# EAGLE design Oddjobv3 (EAGLE 6.4)
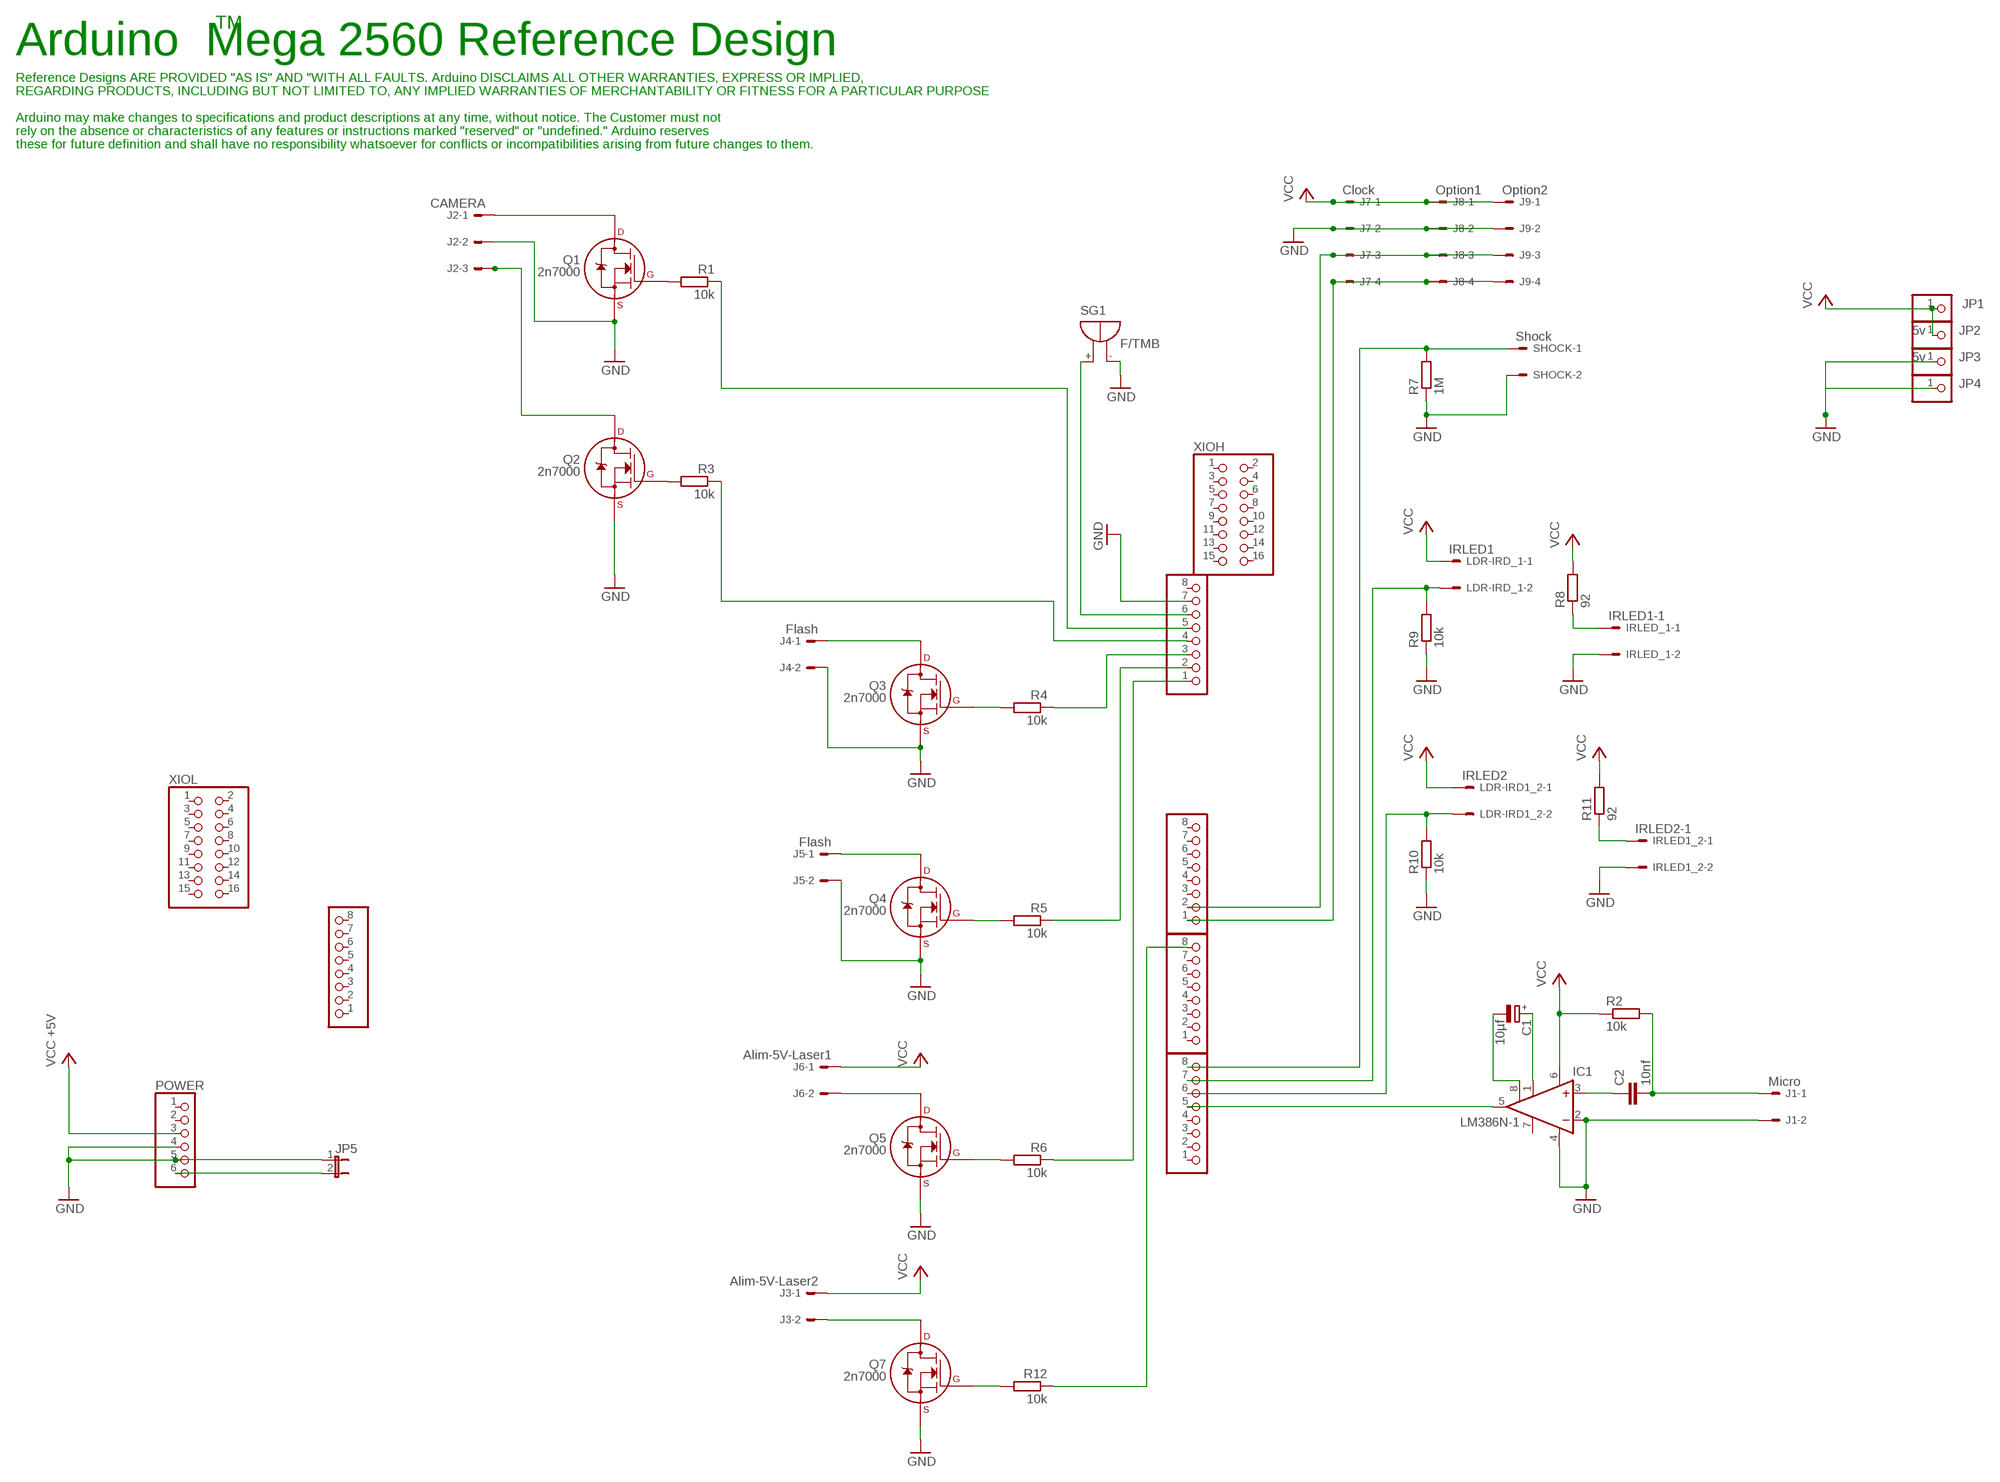
[diagram p0: schematic, sheet 1]

## Parts
ADCH  PINHD-1X8  [1X08]
ADCL  PINHD-1X8  [1X08]
C1  10µf  CPOL-EUE2.5-6  [E2,5-6]
C2  10nf  C-EU050-025X075  [C050-025X075]
COMMUNICATION  PINHD-1X8  [1X08]
IC1  LM386N-1  [DIL08]
IRLED1_2  IRLED2-1  22-27-2021-02  [6410-02]
IRLED_1  IRLED1-1  22-27-2021-02  [6410-02]
J1  Micro  22-27-2021-02  [6410-02]
J2  CAMERA  22-27-2031-03  [6410-03]
J3  Alim-5V-Laser2  22-27-2021-02  [6410-02]
J4  Flash  22-27-2021-02  [6410-02]
J5  Flash  22-27-2021-02  [6410-02]
J6  Alim-5V-Laser1  22-27-2021-02  [6410-02]
J7  Clock  22-27-2041-04  [6410-04]
J8  Option1  22-27-2041-04  [6410-04]
J9  Option2  22-27-2041-04  [6410-04]
JP1  5v  PINHD-1X1  [1X01]
JP2  5v  PINHD-1X1  [1X01]
JP3  PINHD-1X1  [1X01]
JP4  PINHD-1X1  [1X01]
JP5  JP1E  [JP1]
LDR-IRD1_2  IRLED2  22-27-2021-02  [6410-02]
LDR-IRD_1  IRLED1  22-27-2021-02  [6410-02]
POWER  PINHD-1X6  [1X06]
PWMH-NUMERIC  PINHD-1X8  [1X08]
PWML  PINHD-1X8  [1X08]
Q1  2n7000  2N7000_TO92  [TO-92]
Q2  2n7000  2N7000_TO92  [TO-92]
Q3  2n7000  2N7000_TO92  [TO-92]
Q4  2n7000  2N7000_TO92  [TO-92]
Q5  2n7000  2N7000_TO92  [TO-92]
Q7  2n7000  2N7000_TO92  [TO-92]
R1  10k  R-EU_0207/7  [0207/7]
R2  10k  R-EU_0207/7  [0207/7]
R3  10k  R-EU_0207/7  [0207/7]
R4  10k  R-EU_0207/7  [0207/7]
R5  10k  R-EU_0207/7  [0207/7]
R6  10k  R-EU_0207/7  [0207/7]
R7  1M  R-EU_0207/7  [0207/7]
R8  92  R-EU_0207/7  [0207/7]
R9  10k  R-EU_0207/7  [0207/7]
R10  10k  R-EU_0207/7  [0207/7]
R11  92  R-EU_0207/7  [0207/7]
R12  10k  R-EU_0207/7  [0207/7]
SG1  F/TMB  [F/TMB]
SHOCK  Shock  22-27-2021-02  [6410-02]
XIOH  PINHD-2X8  [2X08]
XIOL  PINHD-2X8  [2X08]

## Nets
GND: IC1.2(-IN) IC1.4(GND) IRLED1_2.2 IRLED_1.2 J1.2 J2.2 J4.2 J5.2 J7.2 J8.2 J9.2 JP3.1 JP4.1 JP5.1 POWER.4 POWER.5 PWMH-NUMERIC.7 Q1.1(S) Q2.1(S) Q3.1(S) Q4.1(S) Q5.1(S) Q7.1(S) R7.1 R9.1 R10.1 SG1.- SHOCK.2
N$1: Q1.2(G) R1.2
N$2: J2.1 Q1.3(D)
N$3: C1.+ IC1.1(GAIN)
N$4: C1.- IC1.8(GAIN)
N$5: C2.1 IC1.3(+IN)
N$6: C2.2 J1.1 R2.2
N$7: Q2.2(G) R3.2
N$8: J2.3 Q2.3(D)
N$9: PWMH-NUMERIC.6 SG1.+
N$10: Q3.2(G) R4.2
N$11: J4.1 Q3.3(D)
N$12: J6.2 Q5.3(D)
N$13: Q4.2(G) R5.2
N$14: J5.1 Q4.3(D)
N$15: Q5.2(G) R6.2
N$16: IRLED_1.1 R8.1
N$17: ADCL.7 LDR-IRD_1.2 R9.2
N$18: ADCL.6 LDR-IRD1_2.2 R10.2
N$19: IRLED1_2.1 R11.1
N$20: PWMH-NUMERIC.1 R6.1
N$21: PWMH-NUMERIC.5 R1.1
N$22: PWMH-NUMERIC.2 R5.1
N$23: PWMH-NUMERIC.4 R3.1
N$24: PWMH-NUMERIC.3 R4.1
N$25: ADCL.5 IC1.5(OUT)
N$26: Q7.2(G) R12.2
N$27: J3.2 Q7.3(D)
N$28: ADCL.8 R7.2 SHOCK.1
N$29: COMMUNICATION.1 J7.4 J8.4 J9.4
N$30: PWML.8 R12.1
N$31: COMMUNICATION.2 J7.3 J8.3 J9.3
N$32: JP5.2 POWER.6
VCC: IC1.6(VS) J3.1 J6.1 J7.1 J8.1 J9.1 JP1.1 JP2.1 LDR-IRD1_2.1 LDR-IRD_1.1 POWER.3 R2.1 R8.2 R11.2 ; supply symbol labelled VCC +5V
Unconnected: ADCH.1 ADCH.2 ADCH.3 ADCH.4 ADCH.5 ADCH.6 ADCH.7 ADCH.8 ADCL.1 ADCL.2 ADCL.3 ADCL.4 COMMUNICATION.3 COMMUNICATION.4 COMMUNICATION.5 COMMUNICATION.6 COMMUNICATION.7 COMMUNICATION.8 IC1.7(BYPASS) POWER.1 POWER.2 PWMH-NUMERIC.8 PWML.1 PWML.2 PWML.3 PWML.4 PWML.5 PWML.6 PWML.7 XIOH.1 XIOH.2 XIOH.3 XIOH.4 XIOH.5 XIOH.6 XIOH.7 XIOH.8 XIOH.9 XIOH.10 XIOH.11 XIOH.12 XIOH.13 XIOH.14 XIOH.15 XIOH.16 XIOL.1 XIOL.2 XIOL.3 XIOL.4 XIOL.5 XIOL.6 XIOL.7 XIOL.8 XIOL.9 XIOL.10 XIOL.11 XIOL.12 XIOL.13 XIOL.14 XIOL.15 XIOL.16

## Notes on the sheet
- TM
- Arduino  Mega 2560 Reference Design
- Reference Designs ARE PROVIDED "AS IS" AND "WITH ALL FAULTS. Arduino DISCLAIMS ALL OTHER WARRANTIES, EXPRESS OR IMPLIED,
- REGARDING PRODUCTS, INCLUDING BUT NOT LIMITED TO, ANY IMPLIED WARRANTIES OF MERCHANTABILITY OR FITNESS FOR A PARTICULAR PURPOSE
- Arduino may make changes to specifications and product descriptions at any time, without notice. The Customer must not
- rely on the absence or characteristics of any features or instructions marked "reserved" or "undefined." Arduino reserves
- these for future definition and shall have no responsibility whatsoever for conflicts or incompatibilities arising from future changes to them.

## Library data of the parts
ADCH ADCL COMMUNICATION PWMH-NUMERIC PWML = pinhead:PINHD-1X8: PIN HEADER
C1 = resistor:CPOL-EU: POLARIZED CAPACITOR, European symbol
C2 = resistor:C-EU: CAPACITOR, European symbol
IC1 = linear:LM386?-*: Low Voltage Audio Power Amplifier Source: http://cache.national.com/ds/LM/LM386.pdf
IRLED1_2 IRLED_1 J1 J3-J6 LDR-IRD1_2 LDR-IRD_1 SHOCK = con-molex:22-?-02: CONNECTOR wire to board 2.54 mm (.1 inch) pitch header; OC_FARNELL: unknown; OC_NEWARK: unknown
J2 = con-molex:22-?-03: CONNECTOR wire to board 2.54 mm (.1 inch) pitch header; OC_FARNELL: unknown; OC_NEWARK: unknown
J7-J9 = con-molex:22-?-04: CONNECTOR wire to board 2.54 mm (.1 inch) pitch header; OC_FARNELL: unknown; OC_NEWARK: unknown
JP1-JP4 = pinhead:PINHD-1X1: PIN HEADER
JP5 = jumper:JP1E: JUMPER
POWER = pinhead:PINHD-1X6: PIN HEADER
Q1-Q5 Q7 = transistors:2N700*: 2N7000, 2N7002, NDS7002A N-channel enhancement mode MOSFET
R1-R12 = resistor:R-EU_: RESISTOR, European symbol
SG1 = buzzer:F/TMB: BUZZER Source: Buerklin; OC_FARNELL: unknown; OC_NEWARK: unknown
XIOH XIOL = pinhead:PINHD-2X8: PIN HEADER

## Net classes
0 default: width 0.152 mm, drill 0.305 mm, clearance 0.152 mm

## Board
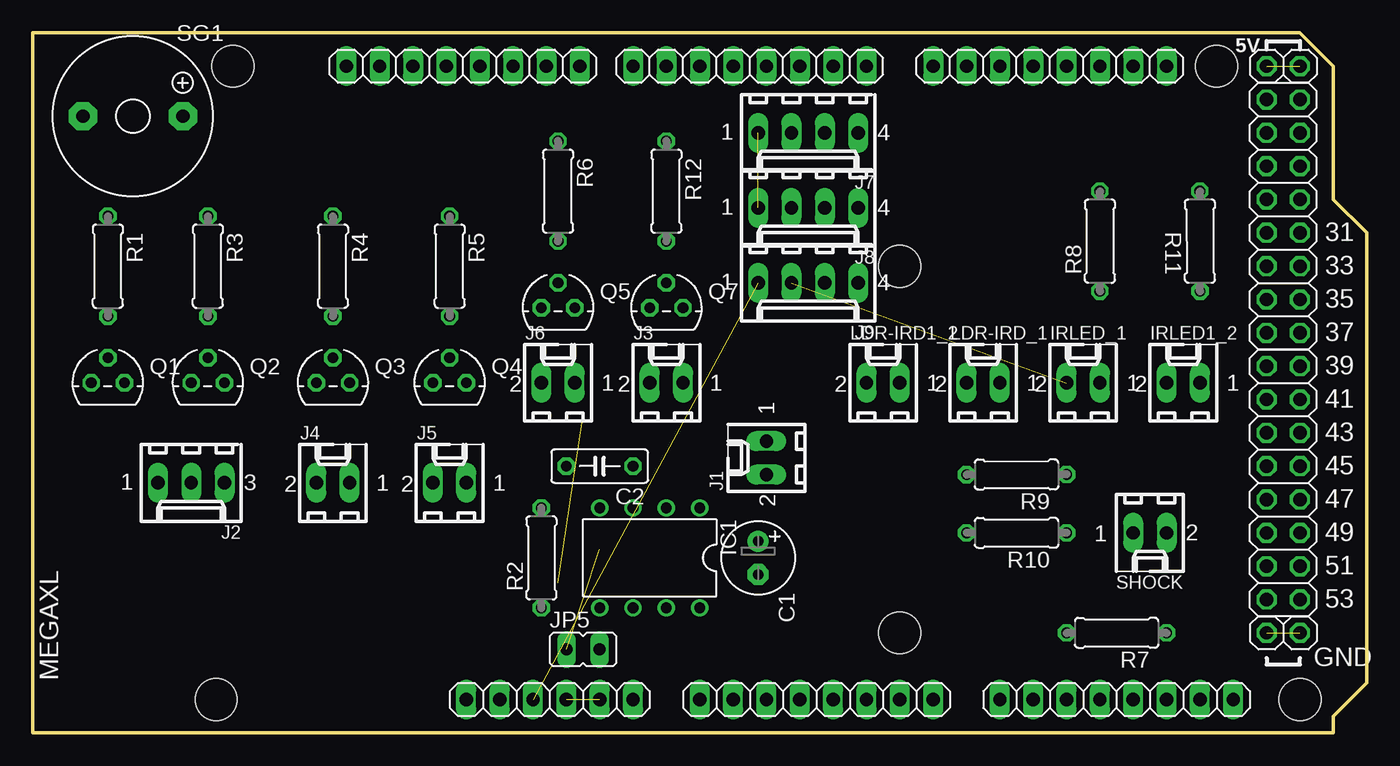
[diagram p1: board, top side]
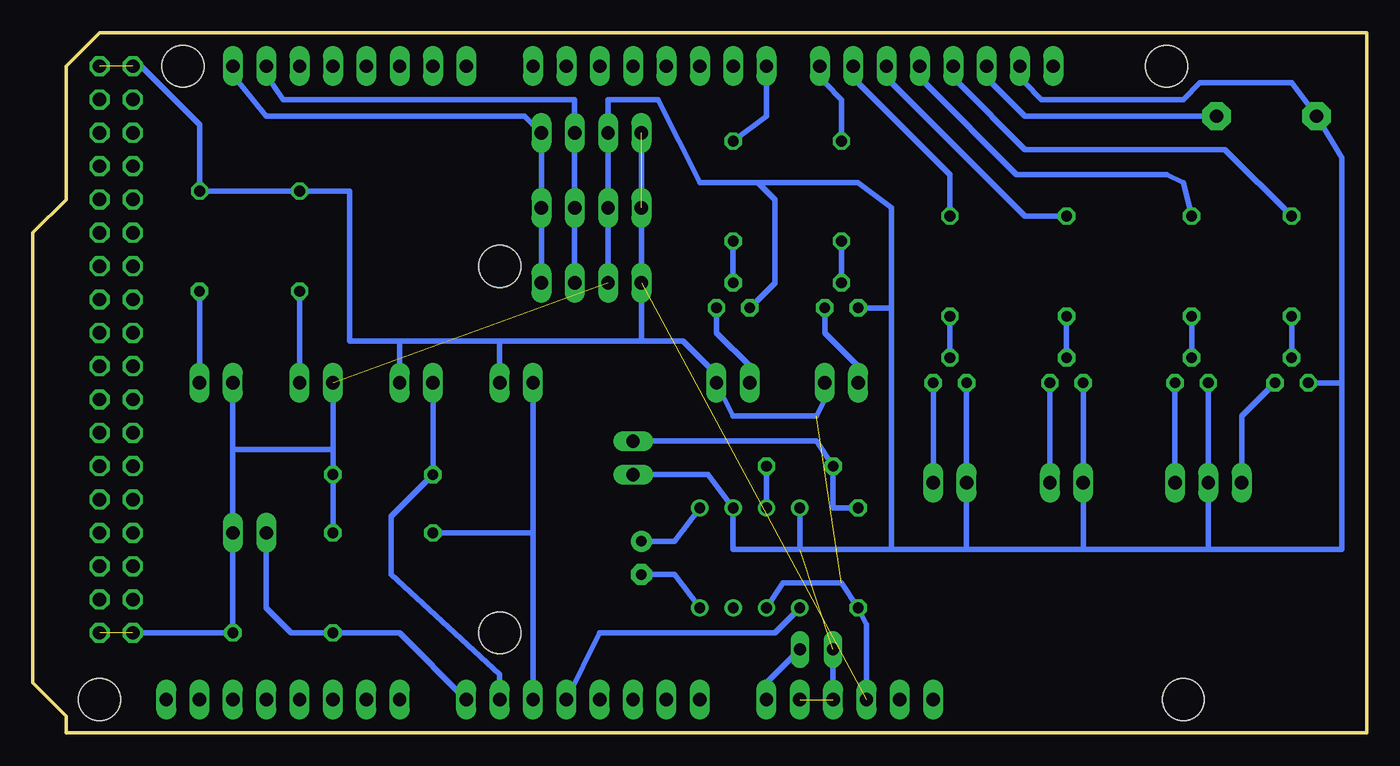
[diagram p2: board, bottom side, seen from below]

Size 101.6 x 53.34 mm. Coordinates in mm from the lower left corner, seen from the top.
Outline: 0,53.34 96.52,53.34 99.06,50.8 99.06,40.64 101.6,38.1 101.6,3.81 99.06,1.27 99.06,0 0,0 0,53.34
Copper layers 1: Top 0.035mm
Design rules "default": minimum track width 6mil, minimum drill 12mil, track to track 6mil, track to pad 6mil, pad to pad 6mil, via to via 6mil, smd to smd 6mil, copper to edge 40mil, drill to drill 12mil, minimum pad ring 10mil, minimum via ring 10mil, stop-mask expansion 2mil, vias tented up to drill 1mil, thermal gap 10mil
Holes 3.2 mm at 96.52,2.54 15.24,50.8 90.17,50.8 13.97,2.54 66.04,35.56 66.04,7.62

### Footprints (pad centres in the part's own frame; a part is rotated, then mirrored left to right if it is on the bottom)
1X08 = drill 1.016 long: 1 -8.89,0; 2 -6.35,0; 3 -3.81,0; 4 -1.27,0; 5 1.27,0; 6 3.81,0; 7 6.35,0; 8 8.89,0
E2,5-6 = drill 0.813 pad 1.6: + -1.27,0 | drill 0.813 pad 1.6 octagon: - 1.27,0
C050-025X075 = drill 0.813 octagon: 1 -2.54,0; 2 2.54,0
DIL08 = drill 0.813 pad 1.27: 1 -3.81,-3.81; 2 -1.27,-3.81; 3 1.27,-3.81; 4 3.81,-3.81; 5 3.81,3.81; 6 1.27,3.81; 7 -1.27,3.81; 8 -3.81,3.81
6410-02 = drill 1.016 long: 1 1.27,0; 2 -1.27,0
6410-03 = drill 1.016 long: 1 2.54,0; 2 0,0; 3 -2.54,0
6410-04 = drill 1.016 long: 1 3.81,0; 2 1.27,0; 3 -1.27,0; 4 -3.81,0
1X01 = drill 1.016 octagon: 1 0,0
JP1 = drill 0.914 long: 1 0,-1.27; 2 0,1.27
1X06 = drill 1.016 long: 1 -6.35,0; 2 -3.81,0; 3 -1.27,0; 4 1.27,0; 5 3.81,0; 6 6.35,0
TO-92 = drill 0.813 octagon: 1 -1.27,0; 2 0,1.905; 3 1.27,0
0207/7 = drill 0.813 octagon: 1 -3.81,0; 2 3.81,0
F/TMB = drill 1.016 pad 2.159 octagon: + 3.81,0; - -3.81,0
2X08 = drill 1.016 octagon: 1 -8.89,-1.27; 2 -8.89,1.27; 3 -6.35,-1.27; 4 -6.35,1.27; 5 -3.81,-1.27; 6 -3.81,1.27; 7 -1.27,-1.27; 8 -1.27,1.27; 9 1.27,-1.27; 10 1.27,1.27; 11 3.81,-1.27; 12 3.81,1.27; 13 6.35,-1.27; 14 6.35,1.27; 15 8.89,-1.27; 16 8.89,1.27

### Placement (x,y rotation side)
ADCH  82.55,2.54 0 top
ADCL  59.69,2.54 0 top
C1  55.24,13.34 270 top
C2  43.18,20.32 180 top
COMMUNICATION  77.47,50.8 180 top
IC1  46.99,13.34 180 top
IRLED1_2  87.63,26.67 0 top
IRLED_1  80.01,26.67 0 top
J1  55.88,20.95 90 top
J2  12.06,19.05 180 top
J3  48.26,26.67 0 top
J4  22.86,19.05 0 top
J5  31.75,19.05 0 top
J6  40.01,26.67 0 top
J7  59.05,45.72 180 top
J8  59.05,40.01 180 top
J9  59.05,34.29 180 top
JP1  93.98,50.8 0 top
JP2  96.52,50.8 0 top
JP3  93.98,7.62 0 top
JP4  96.52,7.62 0 top
JP5  41.91,6.35 270 top
LDR-IRD1_2  64.77,26.67 0 top
LDR-IRD_1  72.39,26.67 0 top
POWER  39.37,2.54 0 top
PWMH-NUMERIC  32.77,50.8 180 top
PWML  54.61,50.8 180 top
Q1  5.71,26.67 0 top
Q2  13.34,26.67 0 top
Q3  22.86,26.67 0 top
Q4  31.75,26.67 0 top
Q5  40.01,32.38 0 top
Q7  48.26,32.38 0 top
R1  5.71,35.56 270 top
R2  38.73,13.34 90 top
R3  13.34,35.56 270 top
R4  22.86,35.56 270 top
R5  31.75,35.56 270 top
R6  40.01,41.27 270 top
R7  82.55,7.62 180 top
R8  81.28,37.47 90 top
R9  74.93,19.68 180.1 top
R10  74.93,15.24 180 top
R11  88.9,37.47 90.1 top
R12  48.26,41.27 270 top
SG1  7.62,46.99 0 top
SHOCK  85.09,15.24 180 top
XIOH  95.25,39.37 90 top
XIOL  95.25,19.05 90 top

### Tracks (layer width: path | path; a pad name or v marks a point on that pad's centre or on a via)
GND  (4 unrouted)
  Bottom 0.406: R7.1 SHOCK.2 | R7.1 86.36,21.59 | R9.1 78.74,20.32 R10.1 78.74,21.59 | Q3.1 J4.2 21.59,13.97 | Q4.1 J5.2 30.48,13.97 | 12.06,13.97 1.91,13.97 1.91,26.67 | 1.91,26.67 1.91,43.81 SG1.- 5.71,49.53 12.7,49.53 13.97,48.26 24.77,48.26 26.04,49.53 26.04,50.42 PWMH-NUMERIC.7 | 21.59,13.97 12.06,13.97 | 30.48,13.97 21.59,13.97 | 30.48,13.97 36.2,13.97 | 36.2,13.97 36.2,32.38 | 43.18,13.97 48.26,13.97 IC1.2 50.16,19.68 J1.2 | 43.18,13.97 36.2,13.97 | Q1.1 1.91,26.67 | 78.74,21.59 86.36,21.59 | 12.06,13.97 J2.2 Q2.1 | Q5.1 36.2,32.38 | 36.2,32.38 36.2,40.01 38.73,41.91 46.35,41.91 | 46.35,41.91 50.8,41.91 53.98,48.26 57.78,48.26 J7.2 J8.2 J9.2 | Q7.1 45.09,34.29 45.09,40.64 46.35,41.91 | R7.1 JP3.1 | IRLED1_2.2 86.36,21.59 | IRLED_1.2 78.74,21.59 | 43.18,13.97 IC1.4 | JP5.1 POWER.4
N$1
  Bottom 0.406: R1.2 Q1.2
N$2
  Bottom 0.406: J2.1 9.53,24.13 Q1.3
N$3
  Bottom 0.406: C1.+ 52.7,14.61 IC1.1
N$4
  Bottom 0.406: IC1.8 52.7,12.06 C1.-
N$5
  Bottom 0.406: C2.1 IC1.3
N$6
  Bottom 0.406: R2.2 40.64,17.14 C2.2 41.91,22.23 J1.1
N$7
  Bottom 0.406: R3.2 Q2.2
N$8
  Bottom 0.406: J2.3 Q2.3
N$9
  Bottom 0.406: SG1.+ 26.04,46.99 28.57,49.53 28.57,50.42 PWMH-NUMERIC.6
N$10
  Bottom 0.406: R4.2 Q3.2
N$11
  Bottom 0.406: J4.1 Q3.3
N$12
  Bottom 0.406: J6.2 38.73,27.94 41.27,30.48 Q5.3
N$13
  Bottom 0.406: R5.2 Q4.2
N$14
  Bottom 0.406: J5.1 Q4.3
N$15
  Bottom 0.406: R6.2 Q5.2
N$16
  Bottom 0.406: IRLED_1.1 R8.1
N$17  (1 unrouted)
  Bottom 0.406: ADCL.7 66.04,4.45 74.3,12.06 74.3,16.51 R9.2 LDR-IRD_1.2
N$18
  Bottom 0.406: ADCL.6 63.5,15.24 | 63.5,15.24 R10.2 | LDR-IRD1_2.2 63.5,15.24
N$19
  Bottom 0.406: IRLED1_2.1 88.9,31.76 R11.1
N$20
  Bottom 0.406: 40.01,47.88 R6.1 40.01,48.26 41.27,49.53 41.91,49.53 41.66,49.78 PWMH-NUMERIC.1
N$21
  Bottom 0.406: PWMH-NUMERIC.5 31.11,50.42 31.11,49.53 26.04,44.45 10.79,44.45 R1.1
N$22
  Bottom 0.406: PWMH-NUMERIC.2 38.73,50.42 38.73,49.53 31.75,42.55 R5.1
N$23
  Bottom 0.406: R3.1 13.97,41.91 15.24,42.55 26.67,42.55 33.66,49.53 33.66,50.42 PWMH-NUMERIC.4
N$24
  Bottom 0.406: PWMH-NUMERIC.3 36.2,50.42 36.2,49.53 26.04,39.37 R4.1
N$25
  Bottom 0.406: IC1.5 45.09,7.62 58.42,7.62 ADCL.5
N$26
  Bottom 0.406: R12.2 Q7.2
N$27
  Bottom 0.406: J3.2 46.99,27.94 49.53,30.48 Q7.3
N$28
  Bottom 0.406: ADCL.8 73.66,7.62 R7.2 81.92,7.62 83.82,9.53 SHOCK.1
N$29
  Bottom 0.406: COMMUNICATION.1 86.36,50.16 83.82,46.99 64.14,46.99 J7.4 J8.4 J9.4
N$30
  Bottom 0.406: PWML.8 45.72,46.99 R12.1
N$31
  Bottom 0.406: COMMUNICATION.2 83.82,50.16 82.55,48.26 60.33,48.26 J7.3 J8.3 J9.3
N$32
  Bottom 0.406: POWER.6 45.72,3.81 JP5.2
VCC  (4 unrouted)
  Bottom 0.406: JP1.1 93.34,50.8 88.9,46.35 R11.2 R8.2 77.47,41.27 77.47,29.84 73.66,29.84 | IC1.6 44.45,11.43 40.01,11.43 R2.1 38.1,8.26 POWER.3 | J6.1 41.27,25.4 41.91,24.13 48.26,24.13 J3.1 49.53,27.3 52.07,29.84 55.24,29.84 | 55.24,29.84 66.04,29.84 | LDR-IRD1_2.1 66.04,29.84 | 66.04,29.84 73.66,29.84 | 73.66,29.84 LDR-IRD_1.1 | J7.1 55.24,29.84

### Text on the board
tPlace: 31 | 33 | 35 | 37 | 39 | 41 | 43 | 45 | 47 | 49 | 51 | 53
tNames: 5V | GND | MEGAXL